# EAGLE design attiny4313_bo (EAGLE 6.2)
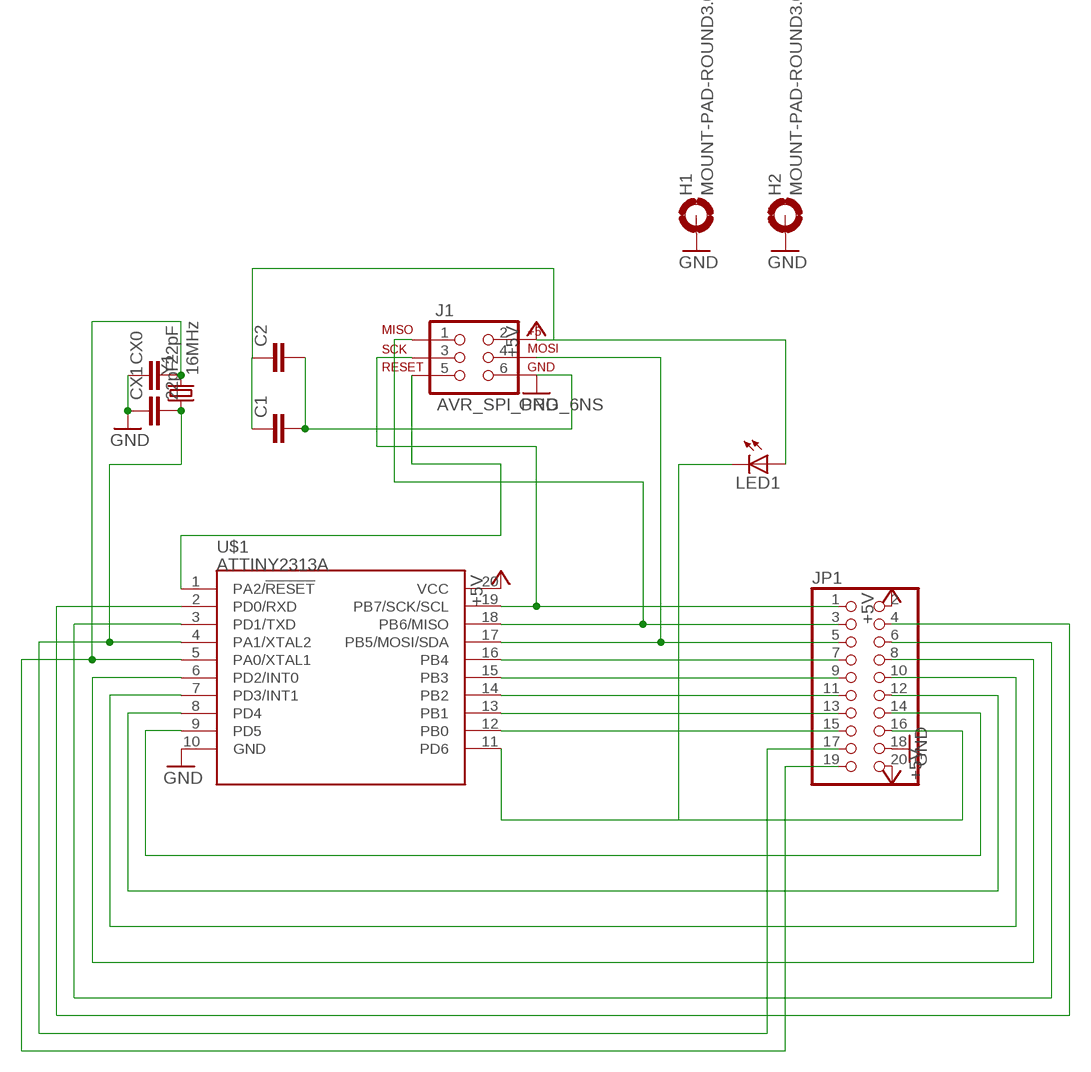
[diagram p0: schematic, sheet 1]

## Parts
C1  C-EUC0805  [C0805]
C2  C-EUC0805  [C0805]
CX0  22pF  C-EUC0603  [C0603]
CX1  22pF  C-EUC0603  [C0603]
H1  MOUNT-PAD-ROUND3.0  [3,0-PAD]
H2  MOUNT-PAD-ROUND3.0  [3,0-PAD]
J1  AVR_SPI_PRG_6NS  [2X3-NS]
JP1  PINHD-2X10  [2X10]
LED1  LED0603  [LED-0603]
U$1  ATTINY2313A  [SOP20]
Y1  16MHz  CRYSTAL5X3  [CRYSTAL-SMD-5X3]

## Nets
+5V [POWER]: C1.1 C2.1 J1.2 JP1.2 JP1.20 LED1.A U$1.20(VCC)
GND [POWER]: C1.2 C2.2 CX0.1 CX1.1 H1.B3,0(MOUNT) H2.B3,0(MOUNT) J1.6 JP1.18 U$1.10(GND)
PA0/XTAL1: CX0.2 JP1.19 U$1.5(PA0/XTAL1) Y1.3
PA1/XTAL2: CX1.2 JP1.17 U$1.4(PA1/XTAL2) Y1.1
PA2/RESET-: J1.5 U$1.1(PA2/!RESET)
PB0: JP1.15 U$1.12(PB0)
PB1: JP1.13 U$1.13(PB1)
PB2: JP1.11 U$1.14(PB2)
PB3: JP1.9 U$1.15(PB3)
PB4: JP1.7 U$1.16(PB4)
PB5/MOSI: J1.4 JP1.5 U$1.17(PB5/MOSI/SDA)
PB6/MISO: J1.1 JP1.3 U$1.18(PB6/MISO)
PB7/SCL: J1.3 JP1.1 U$1.19(PB7/SCK/SCL)
PD0/RDX: JP1.4 U$1.2(PD0/RXD)
PD1/TXD: JP1.6 U$1.3(PD1/TXD)
PD2: JP1.8 U$1.6(PD2/INT0)
PD3: JP1.10 U$1.7(PD3/INT1)
PD4: JP1.12 U$1.8(PD4)
PD5: JP1.14 U$1.9(PD5)
PD6: JP1.16 LED1.C U$1.11(PD6)

## Library data of the parts
C1 C2 CX0 CX1 = rcl:C-EU: CAPACITOR, European symbol
H1 H2 = holes:MOUNT-PAD-ROUND: MOUNTING PAD, round
J1 = SparkFun-Connectors:AVR_SPI_PRG_6: AVR ISP 6 Pin This is the reduced ISP connector for AVR programming. Common on Arduino. This footprint will take up less PCB space and can be used with a 10-pin to 6-pin adapter such as SKU: BOB-08508
JP1 = pinhead:PINHD-2X10: PIN HEADER
LED1 = SparkFun-LED:LED: LEDs Standard schematic elements and footprints for 5mm, 3mm, 1206, and 0603 sized LEDs. 5mm - Spark Fun Electronics SKU : COM-00529 (and others)
U$1 = SparkFun-DigitalIC:ATTINY2313A: ATTINY2313A 2kB 20MHz I2C/SPI/UART
Y1 = SparkFun-FreqCtrl:CRYSTAL: Various standard crystals. Proven footprints. Spark Fun Electronics SKU : COM-00534

## Net classes
1 POWER: width 0.254 mm

## Board
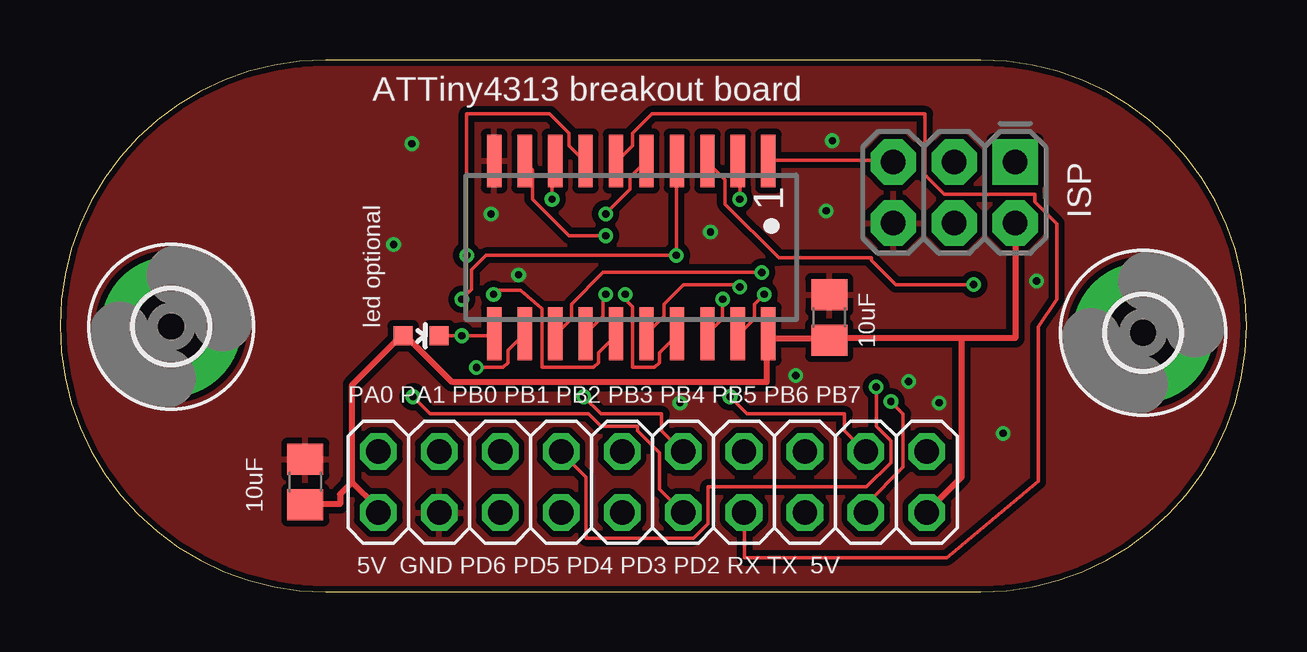
[diagram p1: board, top side]
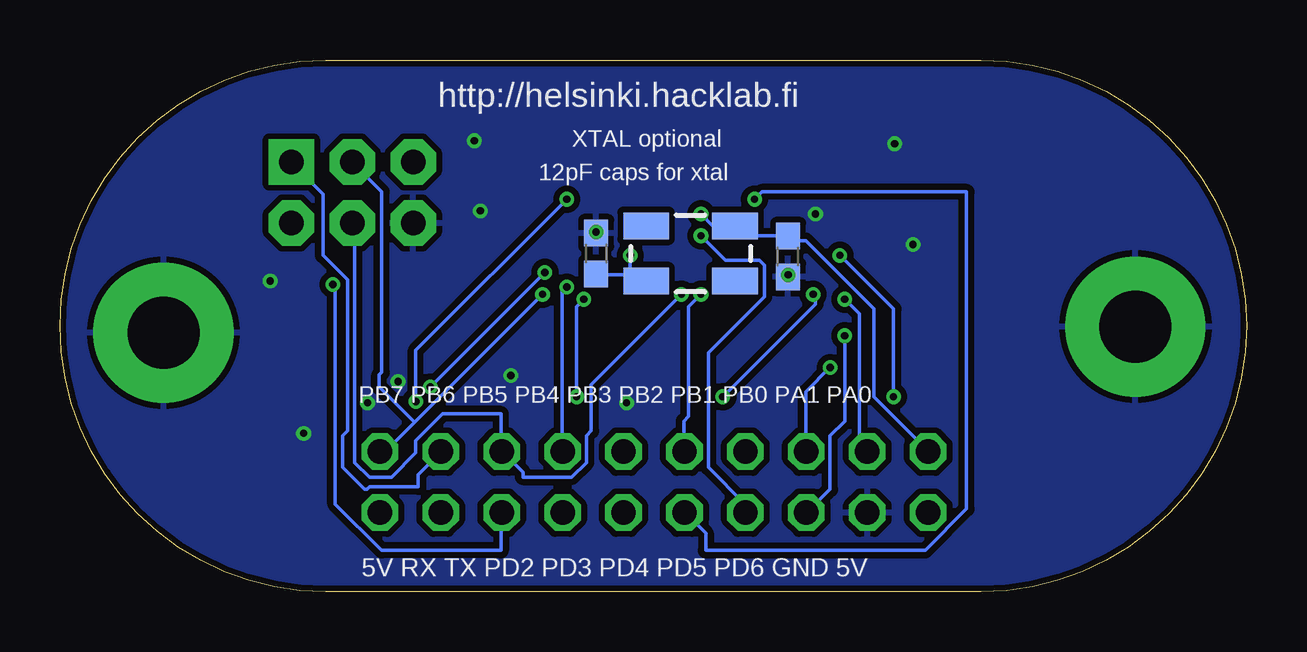
[diagram p2: board, bottom side, seen from below]

Size 49.46 x 22.16 mm. Coordinates in mm from the lower left corner, seen from the top.
Outline: 11.08,22.16 arc180 11.08,0 38.38,0 arc180 38.38,22.16 11.08,22.16
Copper layers (1*16): Top 0.035mm / dielectric 1.5mm / Bottom 0.035mm
Design rules: minimum track width 6mil, minimum drill 12mil, track to track 6mil, track to pad 6mil, pad to pad 6mil, via to via 6mil, smd to smd 0mil, copper to edge 10mil, drill to drill 10mil, minimum pad ring 10mil, minimum via ring 6mil, stop-mask expansion 2mil, vias tented up to drill 100mil, thermal gap 10mil

### Footprints (pad centres in the part's own frame; a part is rotated, then mirrored left to right if it is on the bottom)
C0805 = smd 1.3 x 1.5: 1 -0.95,0; 2 0.95,0
C0603 = smd 1.1 x 1: 1 -0.85,0; 2 0.85,0
3,0-PAD = drill 3 pad 5.842: B3,0 0,0
2X3-NS = drill 1.016 pad 1.88 square: 1 -2.54,-1.27 | drill 1.016 pad 1.88 octagon: 2 -2.54,1.27; 3 0,-1.27; 4 0,1.27; 5 2.54,-1.27; 6 2.54,1.27
2X10 = drill 1.016 octagon: 1 -11.43,-1.27; 2 -11.43,1.27; 3 -8.89,-1.27; 4 -8.89,1.27; 5 -6.35,-1.27; 6 -6.35,1.27; 7 -3.81,-1.27; 8 -3.81,1.27; 9 -1.27,-1.27; 10 -1.27,1.27; 11 1.27,-1.27; 12 1.27,1.27; 13 3.81,-1.27; 14 3.81,1.27; 15 6.35,-1.27; 16 6.35,1.27; 17 8.89,-1.27; 18 8.89,1.27; 19 11.43,-1.27; 20 11.43,1.27
LED-0603 = smd 0.8 x 0.8: A 0,-0.75; C 0,0.75
SOP20 = smd 0.6 x 2.2: 1 -5.715,-3.6; 2 -4.445,-3.6; 3 -3.175,-3.6; 4 -1.905,-3.6; 5 -0.635,-3.6; 6 0.635,-3.6; 7 1.905,-3.6; 8 3.175,-3.6; 9 4.445,-3.6; 10 5.715,-3.6; 11 5.715,3.6; 12 4.445,3.6; 13 3.175,3.6; 14 1.905,3.6; 15 0.635,3.6; 16 -0.635,3.6; 17 -1.905,3.6; 18 -3.175,3.6; 19 -4.445,3.6; 20 -5.715,3.6
CRYSTAL-SMD-5X3 = smd 1.9 x 1.1: 1 -1.85,-1.15; 2 1.85,-1.15; 3 1.85,1.15; 4 -1.85,1.15

### Placement (x,y rotation side)
C1  32.07,11.43 90 top
C2  10.22,4.57 90 top
CX0  19.11,13.97 90 bottom
CX1  27.11,14.1 270 bottom
H1  4.64,11.05 0 top
H2  45.15,10.79 0 top
J1  37.27,16.64 180 top
JP1  24.7,4.57 180 top
LED1  15.05,10.67 270 top
U$1  23.81,14.35 180 top
Y1  23.18,14.1 0 bottom

### Tracks (layer width: path | path; a pad name or v marks a point on that pad's centre or on a via)
+5V
  Top 0.254: 12.18,4.57 12.18,8.64 14.21,10.67 LED1.A 14.41,10.67 16.34,8.74 29.45,8.74 29.45,10.57 U$1.20 29.55,10.67 29.55,10.57 31.99,10.57 C1.1 32.09,10.57 37.58,10.57 | 12.18,4.57 13.2,3.56 13.2,3.35 JP1.20 | C2.1 10.25,3.66 11.67,3.66 11.67,4.06 12.08,4.47 12.08,4.57 12.18,4.57 | 37.58,10.57 39.81,10.57 J1.2 | 37.58,10.57 37.58,4.78 36.16,3.35 JP1.2
GND  (via drill 0.3)
  Top 0.254: U$1.10 18.17,17.98 18.15,18
  other vias: 27.11,14.99 19.11,13.21 17.97,15.75 35.37,8.76 36.64,7.87 25.84,7.87 32.19,18.8 40.7,12.95 39.31,6.6 31.94,15.88 14.67,18.67 13.91,14.48 30.67,9.02
  pour Top (isolate 0.254): -0.32,22.1 -0.32,0 49.85,0 49.72,22.1
  pour Bottom (isolate 0.254): -0.32,22.1 -0.32,0 50.1,-0.13 49.72,22.1
PA0/XTAL1  (via drill 0.3)
  Top 0.152: v22.75,15.75 23.76,16.76 23.76,17.27 24.37,17.88 U$1.5
  Bottom 0.152: v22.75,15.75 22.24,15.24 21.42,15.24 Y1.3 21.32,14.83 19.19,14.83 CX0.2 19.09,14.73 19.09,14.63 18.38,14.63 15.53,11.79 15.53,8.13 13.3,5.89 JP1.19
PA1/XTAL2  (via drill 0.3)
  Top 0.152: U$1.4 25.69,17.88 v25.69,14.02 17.77,14.02 17.16,13.41 17.16,12.6 v16.75,12.19
  Bottom 0.152: 25.69,13.21 25.08,13.21 25.08,13.01 Y1.1 25.69,13.21 | 25.69,13.21 27.11,13.21 CX1.2 | 25.69,13.21 v25.69,14.02 | v16.75,12.19 16.14,11.58 16.14,6.2 15.84,5.89 JP1.17
PA2/RESET-
  Top 0.152: U$1.1 29.55,17.98 34.73,17.98 J1.5
PB0  (via drill 0.3)
  Top 0.152: v17.36,9.35 18.48,9.35 18.68,9.55 18.68,10.06 19.29,10.67 U$1.12
  Bottom 0.152: v17.36,9.35 18.38,8.33 18.38,5.89 JP1.15
PB1  (via drill 0.3)
  Top 0.152: v29.25,13.31 22.64,13.31 21.32,11.99 21.32,11.38 20.71,10.77 U$1.13 | v34.02,8.53 34.02,6.91 34.63,6.3 34.63,5.38 33.62,4.37 27.01,4.37 27.01,2.85 26.4,2.23 21.93,2.23 21.93,4.78 20.92,5.79 JP1.13
  Bottom 0.152: v34.02,8.53 v29.25,13.31
PB2  (via drill 0.3)
  Top 0.152: v22.75,12.39 22.75,12.19 22.64,12.09 22.64,11.48 21.93,10.77 U$1.14
  Bottom 0.152: v22.75,12.39 23.25,11.89 23.25,7.32 23.46,7.11 23.46,5.89 JP1.11
PB3  (via drill 0.3)
  Top 0.152: v18.07,12.39 18.07,12.57 19.19,12.57 20.1,11.79 20.1,9.35 22.24,9.35 22.44,9.55 22.44,9.96 23.15,10.67 U$1.15 | v21.83,8.13 22.54,7.42 25.08,7.42 25.08,6.71 25.9,5.89 JP1.9
  Bottom 0.152: v18.07,12.39 17.97,12.29 17.97,11.99 v21.83,8.13
PB4  (via drill 0.3)
  Top 0.152: v28.33,12.7 28.33,12.8 26,12.8 25.18,11.99 25.18,11.48 24.47,10.77 U$1.16
  Bottom 0.152: v28.33,12.7 28.54,12.5 28.54,5.89 JP1.7
PB5/MOSI  (via drill 0.3)
  Top 0.152: v23.56,12.39 23.56,12.19 23.86,11.89 23.86,9.35 24.78,9.35 24.98,9.55 24.98,9.96 25.69,10.67 U$1.17
  Bottom 0.152: v23.56,12.39 27.32,8.64 27.32,6.71 27.52,6.5 27.52,5.38 28.13,4.78 30.16,4.78 30.16,4.98 30.98,5.79 JP1.5 31.08,5.89 31.08,7.42 33.52,7.42 34.63,6.3 34.63,5.79 35.65,4.78 36.56,4.78 37.17,5.38 37.17,15.24 37.27,15.34 J1.4
PB6/MISO  (via drill 0.3)
  Top 0.152: v27.62,12.19 27.62,11.38 27.01,10.77 U$1.18 | v27.93,8.13 28.64,7.42 32.7,7.42 32.7,6.71 33.52,5.89 JP1.3
  Bottom 0.152: v27.62,12.19 27.93,11.89 v27.93,8.13 | J1.1 39.81,17.88 38.49,16.56 38.49,14.02 37.48,13.01 37.48,6.71 37.68,6.5 37.68,5.18 36.77,4.27 36.66,4.27 36.56,4.37 34.53,4.37 34.53,4.88 33.62,5.79 JP1.3
PB7/SCL  (via drill 0.3)
  Top 0.152: v29.35,12.39 28.94,11.99 28.94,11.38 28.33,10.77 U$1.19
  Bottom 0.152: 34.68,7.06 35.85,5.89 36.06,5.89 JP1.1 | 34.68,7.06 v29.35,12.39 | 34.68,7.06 36.16,8.53 36.16,9.04 36.06,9.14 36.06,16.66 37.27,17.88 J1.3
PD0/RDX  (via drill 0.3)
  Top 0.152: v28.33,16.36 28.33,17.88 U$1.2 | v34.63,7.92 35.14,7.42 35.14,5.18 33.62,3.66 33.62,3.35 JP1.4
  Bottom 0.152: v28.33,16.36 34.63,10.06 v34.63,7.92
PD1/TXD  (via drill 0.3)
  Top 0.152: v38.09,12.8 34.84,12.8 33.82,13.82 33.82,13.92 29.96,13.92 27.72,16.15 27.72,17.17 27.01,17.88 U$1.3
  Bottom 0.152: v38.09,12.8 37.99,12.7 37.99,3.66 36.06,1.73 31.08,1.73 31.08,3.25 JP1.6
PD2
  Top 0.152: U$1.6 23.25,17.98 23.86,18.59 23.86,19.1 24.68,19.91 36.06,19.91 36.06,17.37 36.87,16.56 40.63,16.56 40.63,16.26 41.54,15.34 41.54,12.19 40.78,11.05 40.78,4.6 36.97,1.42 28.54,1.42 28.54,3.25 JP1.8
PD3  (via drill 0.3)
  Top 0.152: v16.95,14.02 16.95,19.91 20.41,19.91 21.22,19.1 21.22,18.59 21.83,17.98 U$1.7 | v14.72,8.13 15.43,7.42 22.03,7.42 22.54,6.91 24.07,6.91 24.07,6.71 24.98,5.79 24.98,4.27 25.9,3.35 JP1.10
  Bottom 0.152: v16.95,14.02 14.72,11.79 v14.72,8.13
PD4  (via drill 0.3)
  Top 0.152: v20.51,16.36 20.51,17.78 20.61,17.88 U$1.8
  Bottom 0.152: v20.51,16.36 20.21,16.66 11.67,16.66 11.67,3.45 13.4,1.73 22.54,1.73 22.54,2.44 23.36,3.25 JP1.12
PD5  (via drill 0.3)
  Top 0.152: v22.75,14.83 21.22,14.83 19.7,16.36 19.7,17.58 19.39,17.88 U$1.9
  Bottom 0.152: v22.75,14.83 21.73,13.82 20.31,13.82 20.1,13.61 20.1,12.29 22.44,9.96 22.44,5.18 20.92,3.66 20.92,3.35 JP1.14
PD6  (via drill 0.3)
  Top 0.152: LED1.C v16.75,10.67 18.07,10.67 U$1.11
  Bottom 0.152: v16.75,10.67 16.75,7.11 17.36,6.5 17.36,4.27 18.28,3.35 JP1.16

### Text on the board
tNames: ATTiny4313 breakout board | ISP | led optional | 10uF | PA0 PA1 PB0 PB1 PB2 PB3 PB4 PB5 PB6 PB7 | 10uF | 5V GND PD6 PD5 PD4 PD3 PD2 RX TX 5V
bNames: http://helsinki.hacklab.fi | XTAL optional | 12pF caps for xtal | PB7 PB6 PB5 PB4 PB3 PB2 PB1 PB0 PA1 PA0 | 5V RX TX PD2 PD3 PD4 PD5 PD6 GND 5V